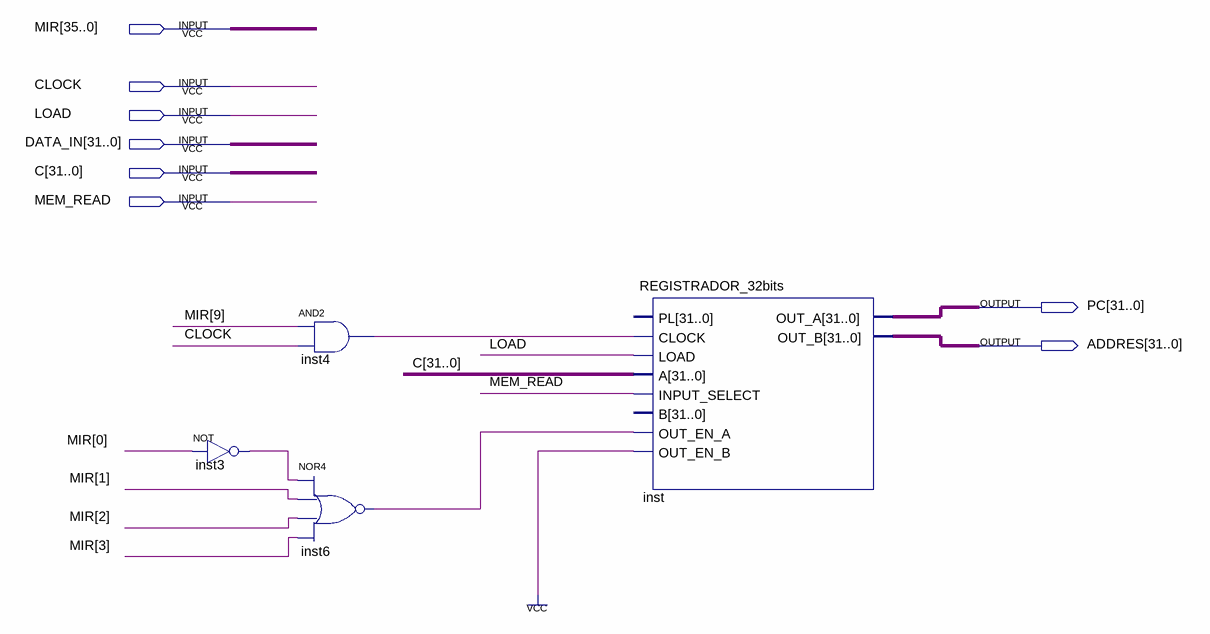
[diagram p0: schematic sheet]
// Quartus schematic PC.bdf as structural Verilog: 4 symbols, 8 pins
module PC (
  input  [35:0] MIR,
  input  CLOCK,
  input  LOAD,
  input  [31:0] DATA_IN,
  input  [31:0] C,
  input  MEM_READ,
  output [31:0] PC,
  output [31:0] ADDRES
);

  wire inst3_out, inst4_out, inst6_out;

  not inst3 (inst3_out, MIR[0]);
  and inst4 (inst4_out, MIR[9], CLOCK);
  nor inst6 (inst6_out, inst3_out, MIR[1], MIR[2], MIR[3]);
  REGISTRADOR_32bits inst (
    .CLOCK(inst4_out), .LOAD(LOAD), .A(C), .INPUT_SELECT(MEM_READ), .OUT_EN_A(inst6_out), .OUT_EN_B(1'b1),
    .OUT_A(PC), .OUT_B(ADDRES));  // open: PL, B
endmodule
